# EAGLE schematic leonino (EAGLE 6.5.0)
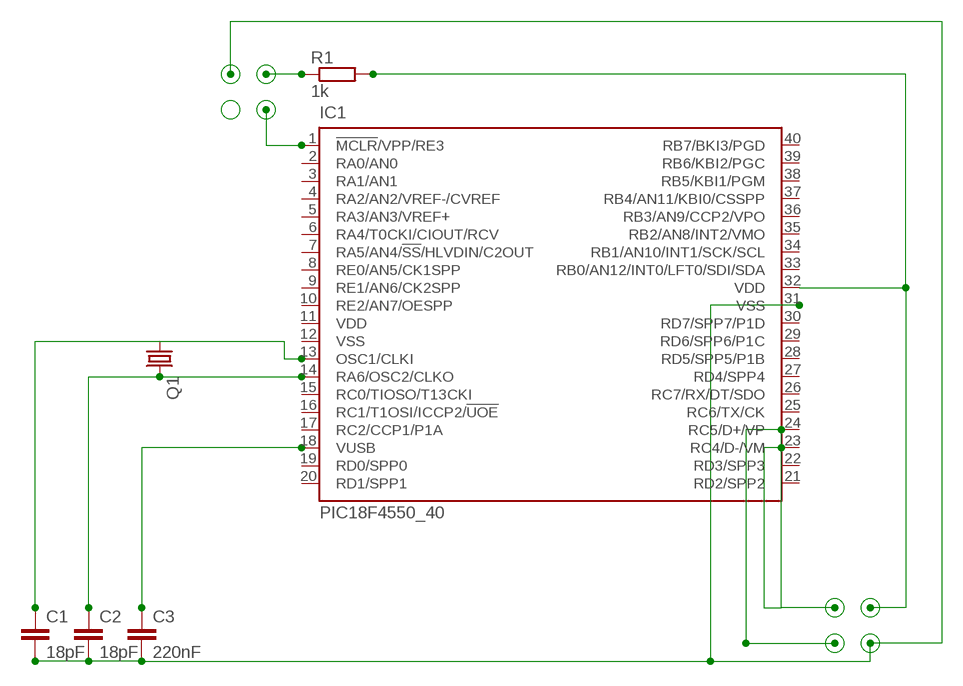
[diagram p0: schematic, sheet 1]

## Parts
C1  18pF  C-EU025-025X050  [C025-025X050]
C2  18pF  C-EU025-025X050  [C025-025X050]
C3  220nF  C-EU025-025X050  [C025-025X050]
IC1  PIC18F4550_40  [DIL40]
Q1  CRYSTALHC49S  [HC49/S]
R1  1k  R-EU_0204/5  [0204/5]

## Nets
N$1: IC1.32(VDD) R1.2
N$2: C3.1 IC1.18(VUSB)
N$4: C1.1 IC1.13(OSC1/CLKI)
N$5: C2.1 IC1.14(RA6/OSC2/CLKO) Q1.2
N$6: R1.1
N$7: IC1.1(!MCLR!/VPP/RE3)
N$8: C1.2 C2.2 C3.2 IC1.31(VSS)
Unconnected: IC1.2(RA0/AN0) IC1.3(RA1/AN1) IC1.4(RA2/AN2/VREF-/CVREF) IC1.5(RA3/AN3/VREF+) IC1.6(RA4/T0CKI/CIOUT/RCV) IC1.7(RA5/AN4/!SS!/HLVDIN/C2OUT) IC1.8(RE0/AN5/CK1SPP) IC1.9(RE1/AN6/CK2SPP) IC1.10(RE2/AN7/OESPP) IC1.15(RC0/TIOSO/T13CKI) IC1.16(RC1/T1OSI/ICCP2/!UOE) IC1.17(RC2/CCP1/P1A) IC1.19(RD0/SPP0) IC1.20(RD1/SPP1) IC1.21(RD2/SPP2) IC1.22(RD3/SPP3) IC1.23(RC4/D-/VM) IC1.24(RC5/D+/VP) IC1.25(RC6/TX/CK) IC1.26(RC7/RX/DT/SDO) IC1.27(RD4/SPP4) IC1.28(RD5/SPP5/P1B) IC1.29(RD6/SPP6/P1C) IC1.30(RD7/SPP7/P1D) IC1.33(RB0/AN12/INT0/LFT0/SDI/SDA) IC1.34(RB1/AN10/INT1/SCK/SCL) IC1.35(RB2/AN8/INT2/VMO) IC1.36(RB3/AN9/CCP2/VPO) IC1.37(RB4/AN11/KBI0/CSSPP) IC1.38(RB5/KBI1/PGM) IC1.39(RB6/KBI2/PGC) IC1.40(RB7/BKI3/PGD) Q1.1

## Power pins joined to a net without a drawn wire
VDD: IC1.11(VDD)
VSS: IC1.12(VSS)

## Library data of the parts
C1-C3 = resistor:C-EU: CAPACITOR, European symbol
IC1 = microchip:PIC18F4*_40: USB Microcontrollers with nanoWatt Technology High-Performance, Enhanced Flash, 28/40/44-Pin, Source: http://ww1.microchip.com/downloads/en/devicedoc/39632c.pdf; MF: MICROCHIP; MPN: PIC18F4550-I/P; OC_FARNELL: 9321357; OC_NEWARK: 74K8623
Q1 = crystal:CRYSTAL: CRYSTAL; OC_FARNELL: 1667008; OC_NEWARK: unknown
R1 = resistor:R-EU_: RESISTOR, European symbol